# EAGLE design detector2 (EAGLE 5.11)
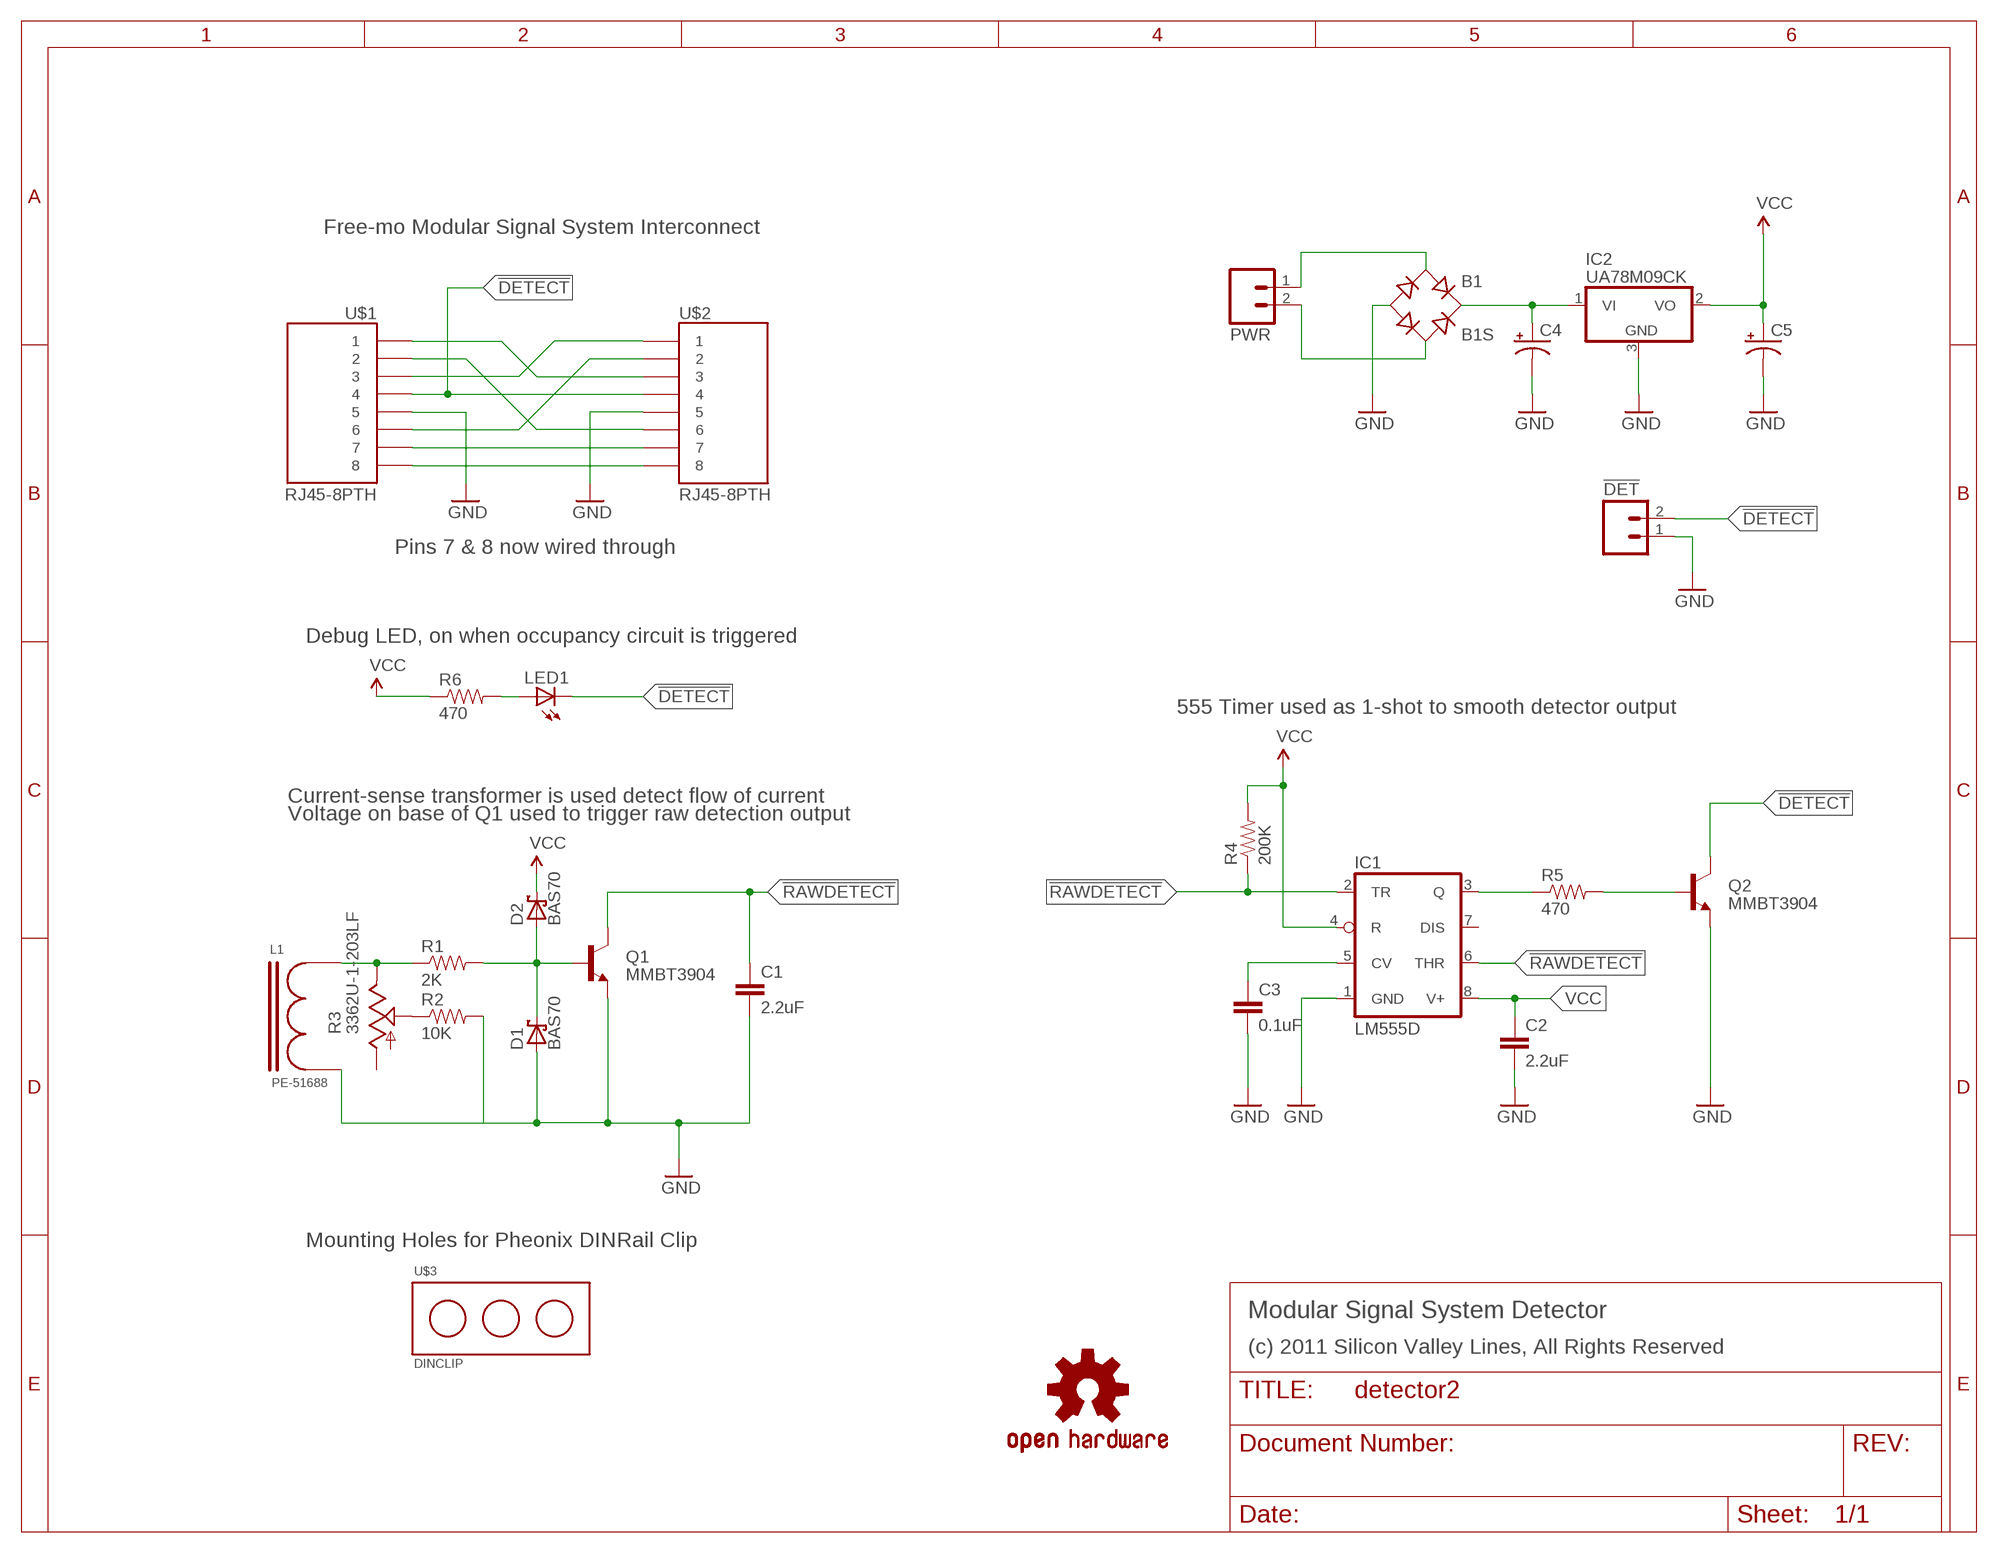
[diagram p0: schematic, sheet 1]

## Parts
!DET  M023.5MM  [SCREWTERMINAL-3.5MM-2]
B1  B1S  [MBS]
C1  2.2uF  CAP0805  [0805]
C2  2.2uF  CAP0805  [0805]
C3  0.1uF  CAP0603-CAP  [0603-CAP]
C4  CAP_POL1206-KIT  [EIA3216-KIT]
C5  CAP_POL1206-KIT  [EIA3216-KIT]
D1  BAS70  [SOT23]
D2  BAS70  [SOT23]
IC1  LM555D  [SO08]
IC2  UA78M09CK  7808DT  [TO252]
L1  PE-51688  PE-5168X  [PE-5168X]
LED1  LED5MM  [LED5MM]
PWR  M025MM  [SCREWTERMINAL-5MM-2]
Q1  MMBT3904  TRANSISTOR_NPNSOT23  [SOT23]
Q2  MMBT3904  TRANSISTOR_NPNSOT23  [SOT23]
R1  2K  RESISTOR0805-RES  [0805]
R2  10K  RESISTOR0603-RES  [0603-RES]
R3  3362U-1-203LF  TRIM_US-B25U  [B25U]
R4  200K  RESISTOR0603-RES  [0603-RES]
R5  470  RESISTOR0603-RES  [0603-RES]
R6  470  RESISTOR0603-RES  [0603-RES]
U$1  RJ45-8PTH  [RJ45-8]
U$2  RJ45-8PTH  [RJ45-8]
U$3  DINCLIP  [1201578]
U$4  OSHW-LOGOM  [OSHW-LOGO-M]

## Nets
!DETECT: !DET.2 LED1.K(C) Q2.3(C) U$1.4 U$2.4
!RAWDETECT: C1.1 IC1.2(TR) IC1.6(THR) Q1.3(C) R4.1
GND: !DET.1 B1.- C1.2 C2.2 C3.2 C4.C(-) C5.C(-) D1.1(A) IC1.1(GND) IC2.3(GND) L1.P$2 Q1.2(E) Q2.2(E) R2.2 U$1.5 U$2.5
N$1: U$1.1 U$2.3
N$2: U$1.3 U$2.1
N$3: U$1.2 U$2.6
N$4: U$1.6 U$2.2
N$5: L1.P$1 R1.1 R3.E
N$6: U$1.7 U$2.7
N$7: R2.1 R3.S
N$8: D1.3(C) D2.1(A) Q1.1(B) R1.2
N$9: IC1.3(Q) R5.1
N$10: LED1.A R6.2
N$11: C3.1 IC1.5(CV)
N$12: Q2.1(B) R5.2
N$13: U$1.8 U$2.8
N$14: B1.+ C4.A(+) IC2.1(VI)
VCC: C2.1 C5.A(+) D2.3(C) IC1.4(R) IC1.8(V+) IC2.2(VO) R4.2 R6.1
VIN1: B1.AC1 PWR.1
VIN2: B1.AC2 PWR.2
Unconnected: IC1.7(DIS) R3.A

## Notes on the sheet
- Free-mo Modular Signal System Interconnect
- Pins 7 & 8 now wired through
- Debug LED, on when occupancy circuit is triggered
- 555 Timer used as 1-shot to smooth detector output
- Current-sense transformer is used detect flow of current
- Voltage on base of Q1 used to trigger raw detection output
- Mounting Holes for Pheonix DINRail Clip
- Modular Signal System Detector
- (c) 2011 Silicon Valley Lines, All Rights Reserved

## Library data of the parts
!DET PWR = SparkFun:M02: Header 2 Standard 2-pin 0.1" header. Use with straight break away headers (SKU : PRT-00116), right angle break away headers (PRT-00553), swiss pins (PRT-00743), machine pins (PRT-00117), and female headers (PRT-00115). Molex polarized connector foot print use with SKU : PRT-08233 with associated crimp pins and housings.
B1 = rectifier:B*S: Surface Mount Glass Passivated Bridge Rectifiers Source: Comchip Bridge Rectifiers B05S-G_B10S-G.pdf
C1-C3 = SparkFun:CAP: Capacitor Standard 0603 ceramic capacitor, and 0.1" leaded capacitor.
C4 C5 = SparkFun:CAP_POL: Capacitor Polarized These are standard SMD and PTH capacitors. Normally 10uF, 47uF, and 100uF in electrolytic and tantalum varieties. Always verify the external diameter of the through hole cap, it varies with capacity, voltage, and manufacturer. The EIA devices should be standard.
D1 D2 = diode:BAS70: Silicon Schottky Diodes General-purpose diode for high-speed switching
IC1 = linear:*555: TIMER
IC2 = linear:78*: Positive VOLTAGE REGULATOR Source: http://cache.national.com/ds/LM/LM78L05.pdf http://www.fairchildsemi.com/ds/LM/LM7805.pdf
L1 = PE-5168X:PE-5168X: PE-5168X Current Sense Inductor
LED1 = SparkFun:LED: LEDs Standard schematic elements and footprints for 5mm, 3mm, 1206, and 0603 sized LEDs. 5mm - Spark Fun Electronics SKU : COM-00529 (and others)
Q1 Q2 = SparkFun:TRANSISTOR_NPN: Transistor NPN BJT configuration in SOT23 package. MMBT2222 is the common NPN we use. Double check BCE configuration again layout.
R1 R2 R4-R6 = SparkFun:RESISTOR: Resistor Basic schematic elements and footprints for 0603, 1206, and PTH resistors.
R3 = pot:TRIM_US-: POTENTIOMETER
U$1 U$2 = SparkFun:RJ45-8: RJ45 Jack Simple RJ45, 8-pin connection - connector for common Cat5, Cat5e, and Cat6 Ethernet cables. Footprint not yet proven in production. Connector sku is PRT-00643; Breakout PCB sku is BOB-00716.
U$3 = DINCLIP:DINCLIP
U$4 = SparkFun:OSHW-LOGO: Open Source Hardware Logo This logo indicates the piece of hardware it is found on incorporates a OSHW license and/or adheres to the definition of open source hardware found here: http://freedomdefined.org/OSHW

## Board
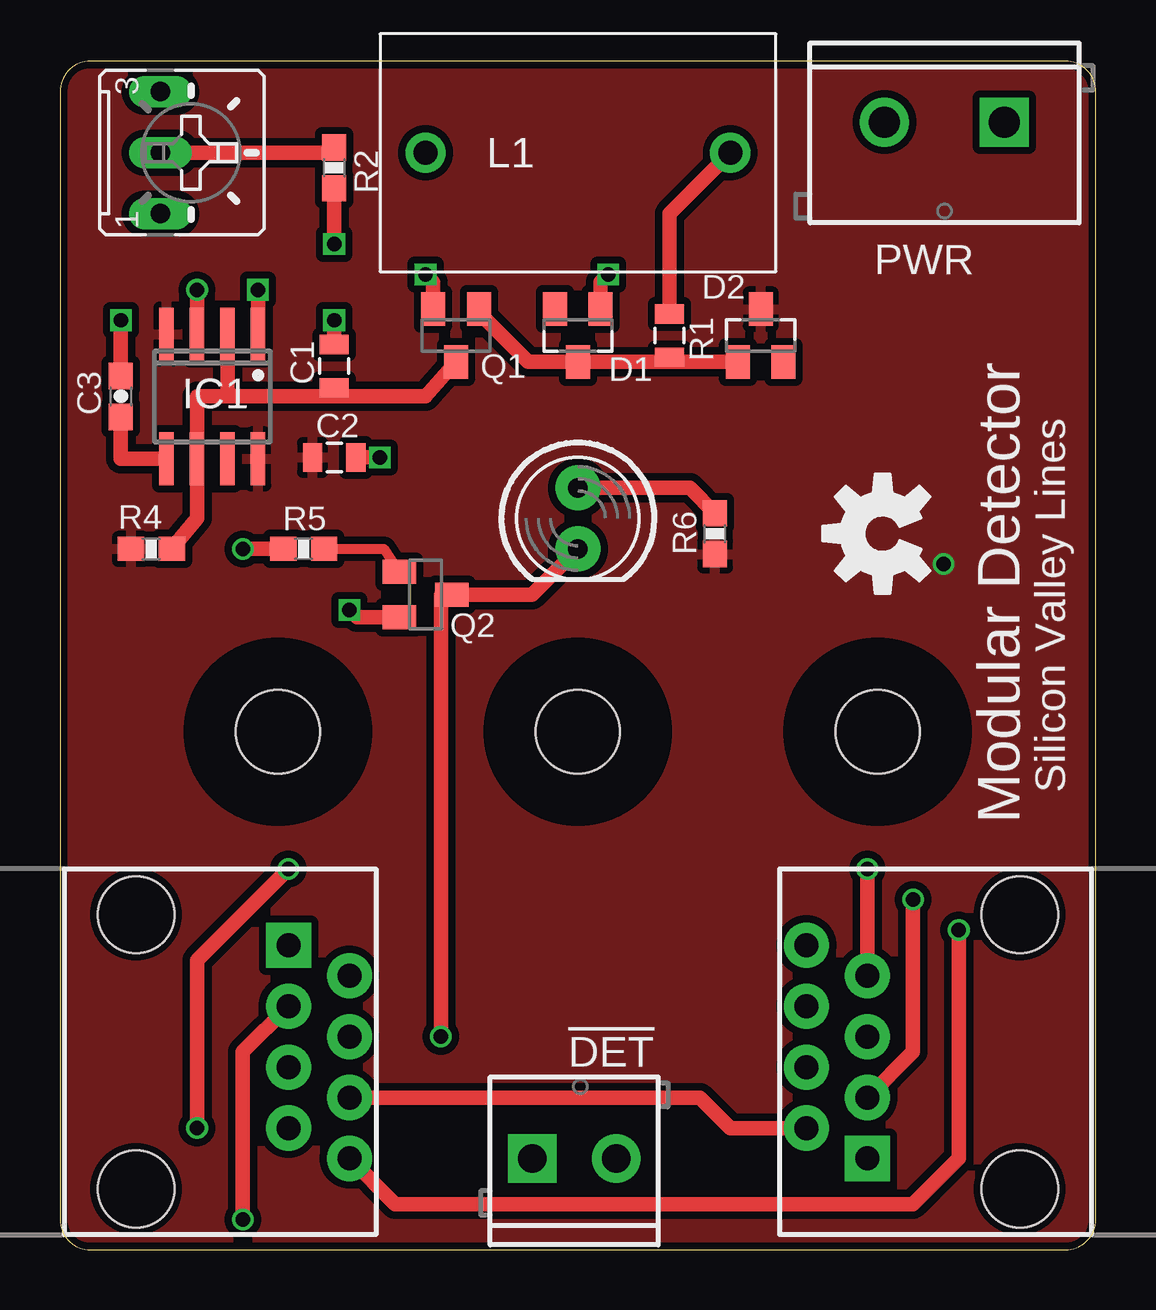
[diagram p1: board, top side]
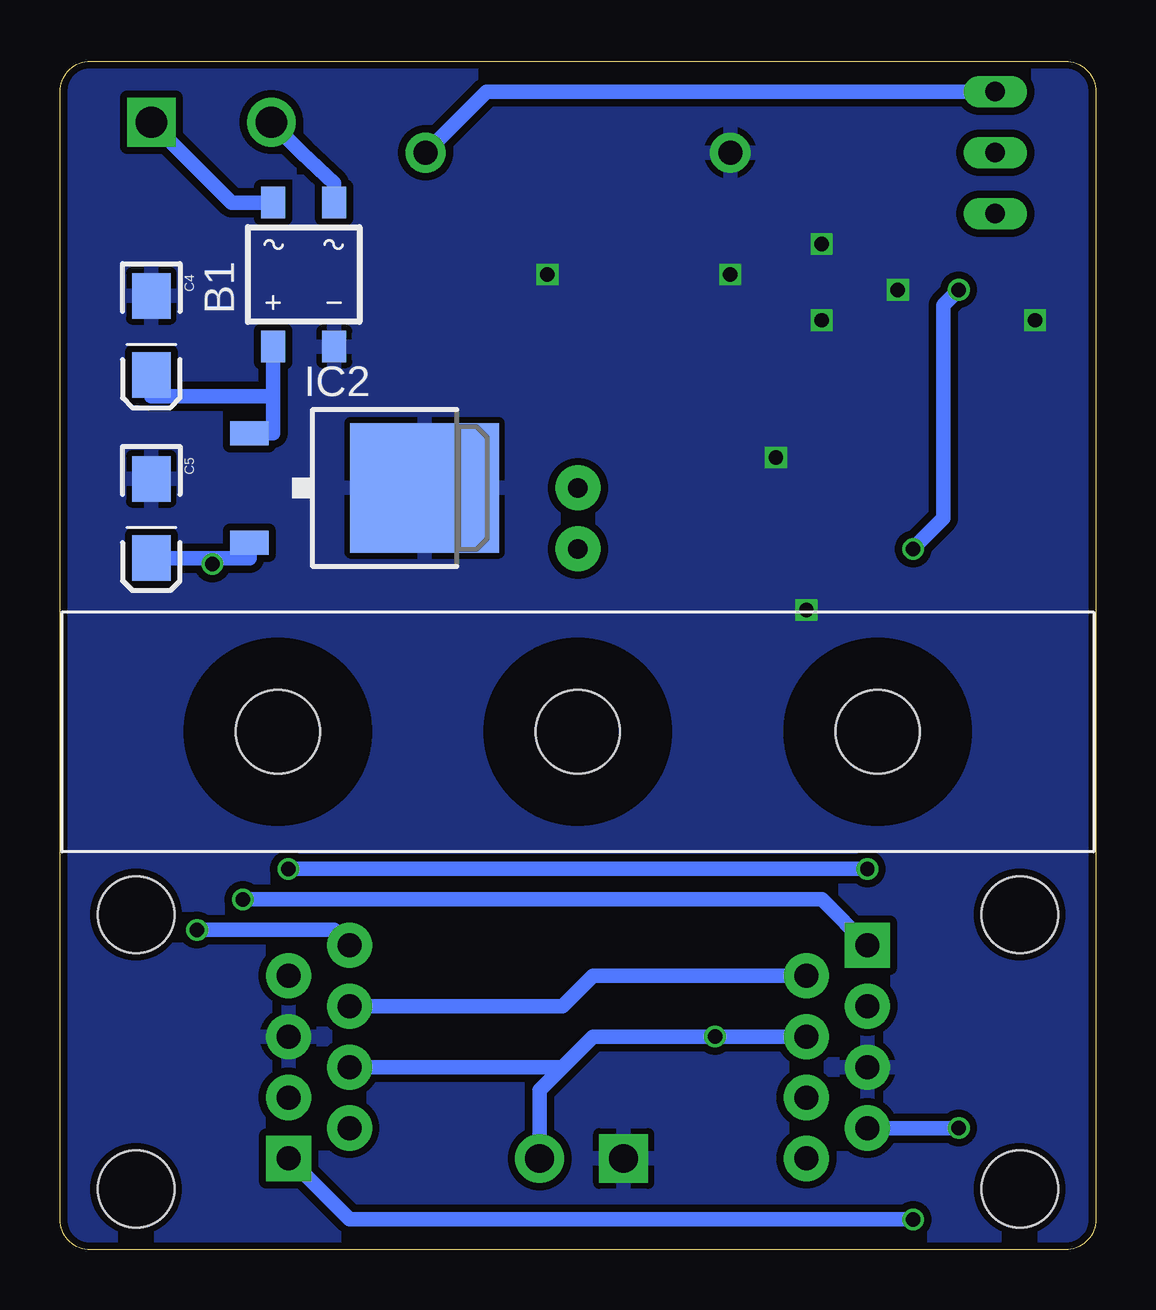
[diagram p2: board, bottom side, seen from below]

Size 43.18 x 49.53 mm. Coordinates in mm from the lower left corner, seen from the top.
Outline: 43.18,48.26 arc90 41.91,49.53 1.27,49.53 arc90 0,48.26 0,1.27 arc90 1.27,0 41.91,0 arc90 43.18,1.27 43.18,48.26
Copper layers (1*16): Top 0.035mm / dielectric 1.5mm / Bottom 0.035mm
Design rules "Fusion_eagle_rule_v1.1": minimum track width 6mil, minimum drill 12mil, track to track 6mil, track to pad 6mil, pad to pad 6mil, via to via 6mil, smd to smd 0mil, copper to edge 10mil, drill to drill 10mil, minimum pad ring 10mil, minimum via ring 6mil, stop-mask expansion 2mil, vias tented up to drill 100mil, thermal gap 10mil

### Footprints (pad centres in the part's own frame; a part is rotated, then mirrored left to right if it is on the bottom)
SCREWTERMINAL-3.5MM-2 = drill 1.2 pad 2.032 square: 1 0,0 | drill 1.2 pad 2.032 round: 2 3.5,0
MBS = smd 1 x 1.3: + -1.27,-3; - 1.27,-3; AC1 -1.27,3; AC2 1.27,3
0805 = smd 0.8 x 1.2: 1 -0.9,0; 2 0.9,0
0603-CAP = smd 1.1 x 1: 1 -0.85,0; 2 0.85,0
EIA3216-KIT = smd 1.9 x 1.6: A 1.65,0; C -1.65,0
SOT23 = smd 1 x 1.4: 1 -0.95,-1.1; 2 0.95,-1.1; 3 0,1.1
SO08 = smd 0.6 x 2.2: 1 -1.905,-2.6; 2 -0.635,-2.6; 3 0.635,-2.6; 4 1.905,-2.6; 5 1.905,2.6; 6 0.635,2.6; 7 -0.635,2.6; 8 -1.905,2.6
TO252 = smd 1 x 1.6: 1 -2.28,-4.8; 2 2.28,-4.8 | smd 5.4 x 6.2: 3 0,2.5
PE-5168X = drill 1 pad 1.676 round: P$1 0,0; P$2 12.7,0
LED5MM = drill 0.813 pad 1.88 round: A -1.27,0; K 1.27,0
SCREWTERMINAL-5MM-2 = drill 1.3 pad 2.032 square: 1 0,0 | drill 1.3 pad 2.032 round: 2 5,0
0603-RES = smd 1.1 x 1: 1 -0.85,0; 2 0.85,0
B25U = drill 0.813 long: A 2.54,-0.889; E -2.54,-0.889; S 0,-0.889
RJ45-8 = drill 1 pad 1.88 square: 1 -4.445,6.35 | drill 1 pad 1.88 round: 2 -3.175,8.89; 3 -1.905,6.35; 4 -0.635,8.89; 5 0.635,6.35; 6 1.905,8.89; 7 3.175,6.35; 8 4.445,8.89 | hole 3.2: -5.715,0; 5.715,0
1201578 = hole 3.5: 0,0; 12.5,0; -12.5,0

### Placement (x,y rotation side)
!DET  19.68,3.81 0 top
B1  33.02,40.64 0 bottom
C1  11.43,36.83 90 top
C2  11.43,33.02 0 top
C3  2.54,35.56 90 top
C4  39.37,38.1 270 bottom
C5  39.37,30.48 270 bottom
D1  21.59,38.1 180 top
D2  29.21,38.1 0 top
IC1  6.35,35.56 180 top
IC2  30.48,31.75 270 bottom
L1  27.94,45.72 180 top
LED1  21.59,30.48 270 top
PWR  39.37,46.99 180 top
Q1  16.51,38.1 180 top
Q2  15.24,27.3 270 top
R1  25.4,38.1 270 top
R2  11.43,45.09 270 top
R3  5.08,45.72 270 top
R4  3.81,29.21 180 top
R5  10.16,29.21 0 top
R6  27.3,29.84 90 top
U$1  40.01,8.26 90 top
U$2  3.17,8.26 270 top
U$3  21.59,21.59 0 top
U$4  34.29,29.84 90 top

### Tracks (layer width: path | path; a pad name or v marks a point on that pad's centre or on a via)
!DETECT  (via drill 0.6)
  Top 0.61: v15.88,8.89 15.88,27.3 Q2.3 19.68,27.3 LED1.K
  Bottom 0.61: U$2.4 v15.88,8.89 20.95,8.89 22.23,7.62 | 22.23,7.62 U$1.4 | !DET.2 23.18,6.66 22.23,7.62
!RAWDETECT
  Top 0.61: R4.1 5.71,30.48 IC1.6 5.71,35.56 6.99,35.56 | 6.99,35.56 IC1.2 | 6.99,35.56 11.43,35.56 | 11.43,35.56 15.24,35.56 Q1.3 | 11.43,35.56 C1.1
GND  (via drill 0.6)
  Top 0.61: IC1.1 8.26,38.1 | C3.2 v2.54,38.73 | IC1.1 v8.26,40.01 | 8.26,37.47 IC1.1 | Q2.2 12.38,26.36 v12.06,26.67 | Q1.2 15.56,40.32 v15.24,40.64 | D1.1 22.54,40.32 v22.86,40.64 | C1.2 v11.43,38.73 | C2.2 v13.34,33.02 | v11.43,41.91 R2.2
  pour Bottom (isolate 0.305): 0,0 0,49.53 43.18,49.53 43.18,0
N$1  (via drill 0.6)
  Top 0.61: v7.62,1.27 7.62,8.26 U$2.3
  Bottom 0.61: U$1.1 31.11,1.27 v7.62,1.27
N$2  (via drill 0.6)
  Top 0.61: U$1.3 35.56,8.26 v35.56,14.61
  Bottom 0.61: U$2.1 11.43,14.61 v35.56,14.61
N$3
  Top 0.61: U$1.2 27.94,5.08 26.67,6.35 U$2.6
N$4
  Bottom 0.61: U$2.2 20.95,11.43 22.23,10.16 U$1.6
N$5
  Top 0.61: R1.1 25.4,43.18 L1.P$1
  Bottom 0.61: R3.E 25.4,48.26 L1.P$1
N$6  (via drill 0.6)
  Top 0.61: v33.66,15.88 U$1.7 | v9.53,15.88 5.71,12.06 v5.71,5.08
  Bottom 0.61: v9.53,15.88 v33.66,15.88 | v5.71,5.08 U$2.7
N$7
  Top 0.61: R2.1 11.21,45.72 R3.S
N$8
  Top 0.61: Q1.1 17.46,39.05 19.52,37 D1.3 25.2,37 | 25.2,37 R1.2 | 25.2,37 D2.1
N$9  (via drill 0.6)
  Top 0.61: v5.71,40.01 IC1.3 | R5.1 v7.62,29.21
  Bottom 0.61: v7.62,29.21 6.35,30.48 6.35,39.37 v5.71,40.01
N$10
  Top 0.61: LED1.A 26.25,31.75 R6.2
N$11
  Top 0.61: IC1.5 2.54,32.96 C3.1
N$12
  Top 0.406: R5.2 13.51,29.21 Q2.1
N$13  (via drill 0.6)
  Top 0.61: U$2.8 13.97,1.91 35.56,1.91 37.47,3.81 v37.47,13.34
  Bottom 0.61: U$1.8 31.75,13.34 v37.47,13.34
N$14
  Bottom 0.61: 34.29,35.56 34.29,34.03 IC2.1 | 34.29,35.56 B1.+ | C4.A 39.37,35.56 34.29,35.56
VCC  (via drill 0.6)
  Top 0.61: IC1.8 8.26,33.02
  Bottom 0.61: IC2.2 35.28,28.83 36.83,28.83 | 36.83,28.83 C5.A | 36.83,28.83 v36.83,28.57
  pour Top (isolate 0.305): 0,49.53 43.18,49.53 43.18,0 0,0
VIN1
  Bottom 0.61: B1.AC1 36.02,43.64 PWR.1
VIN2
  Bottom 0.61: B1.AC2 31.75,44.45 33.1,45.72 PWR.2

### Text on the board
tPlace: Silicon Valley Lines | Modular Detector